# Altium schematic sheet Sheet2.SchDoc
size A; SheetNumber: 2; SheetTotal: 2
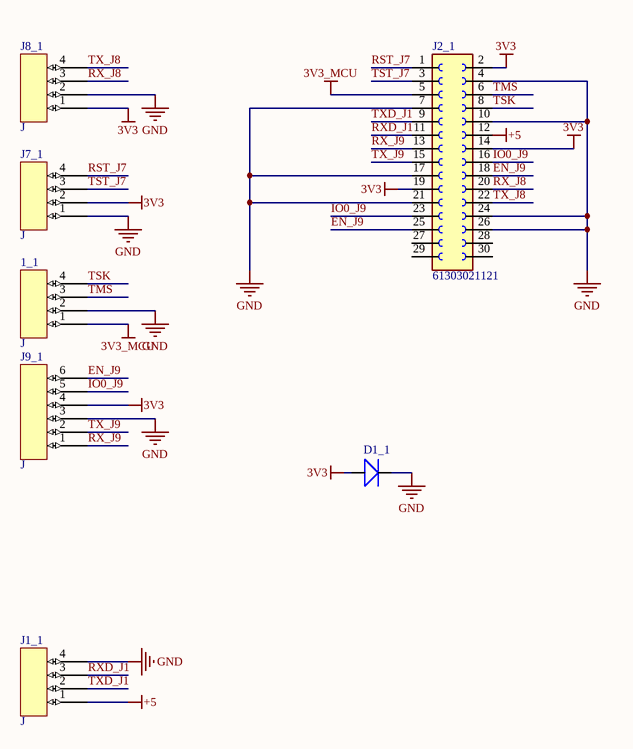
[diagram p0: Sheet2.SchDoc]

## Parts
1_1  J  [J4]
D1_1  SMD-DIODE-SWITCHING-75V-150MA(D1206)  [LED-1206]  (value not drawn)
J1_1  J  [J4]
J2_1  61303021121  [61303021121]
J7_1  J  [J4]
J8_1  J  [J4]
J9_1  J  [J6]

## Nets
3V3: D1_1.POS J2_1.2 J2_1.14 J2_1.19 J7_1.2 J8_1.1 J9_1.4
3V3_MCU: 1_1.1 J2_1.5
+5: J1_1.1 J2_1.12
GND: 1_1.2 D1_1.NEG J1_1.4 J2_1.4 J2_1.7 J2_1.10 J2_1.17 J2_1.21 J2_1.24 J2_1.26 J7_1.1 J8_1.2 J9_1.3
EN_J9: J2_1.18 J2_1.25 J9_1.6
IO0_J9: J2_1.16 J2_1.23 J9_1.5
RST_J7: J2_1.1 J7_1.4
RX_J8: J2_1.20 J8_1.3
RX_J9: J2_1.13 J9_1.1
RXD_J1: J1_1.3 J2_1.11
TMS: 1_1.3 J2_1.6
TSK: 1_1.4 J2_1.8
TST_J7: J2_1.3 J7_1.3
TX_J8: J2_1.22 J8_1.4
TX_J9: J2_1.15 J9_1.2
TXD_J1: J1_1.2 J2_1.9

Not connected (* = marked no-connect by the designer): J2_1 27(14) 28(17) 29(15) 30(16)

## Library data of the parts
1_1 J1_1 J7_1 J8_1 = J4
D1_1 = SMD-DIODE-SWITCHING-75V-150MA(D1206): 304040005; MF: {'manufacturer': u'Bourns'}; Package: None; Availability: Unavailable; Price: None; MP: SMD-DIODE-SWITCHING-75V-150MA(D1206); Value: *
J2_1 = 61303021121: <b> WR-PHD 2.54mm Dual Pin Header, 30 Pins </b>=>Code : Con_BTB_PHD_2.54_2_61303021121 <br><a href="http://katalog.we-online.de/media/images/eican/Con_BTB_PHD_2.54_2_6130xx21121_pf2.jpg" title="Enlarge picture"> <img src="http://katalog.we-online.de/media/thumbs2/eican/thb_Con_BTB_PHD_2.54_2_6130xx21121_pf2.jpg" width="320"></a><p> Details see: <a href="http://katalog.we-online.de/en/em/613_0xx_211_21">http://katalog.we-online.de/en/em/613_0xx_211_21</a><p> Created 2014-05-29, Karrer Zheng<br> 2014 (C) WÃ¼rth Elektronik; MF: {'manufacturer': u'Wurth Elektronik'}; Package: None; Availability: Unavailable; Price: None; MP: 61303021121; Value: *
J9_1 = J6